# Altium schematic sheet Power_Distribution.SchDoc
size A4
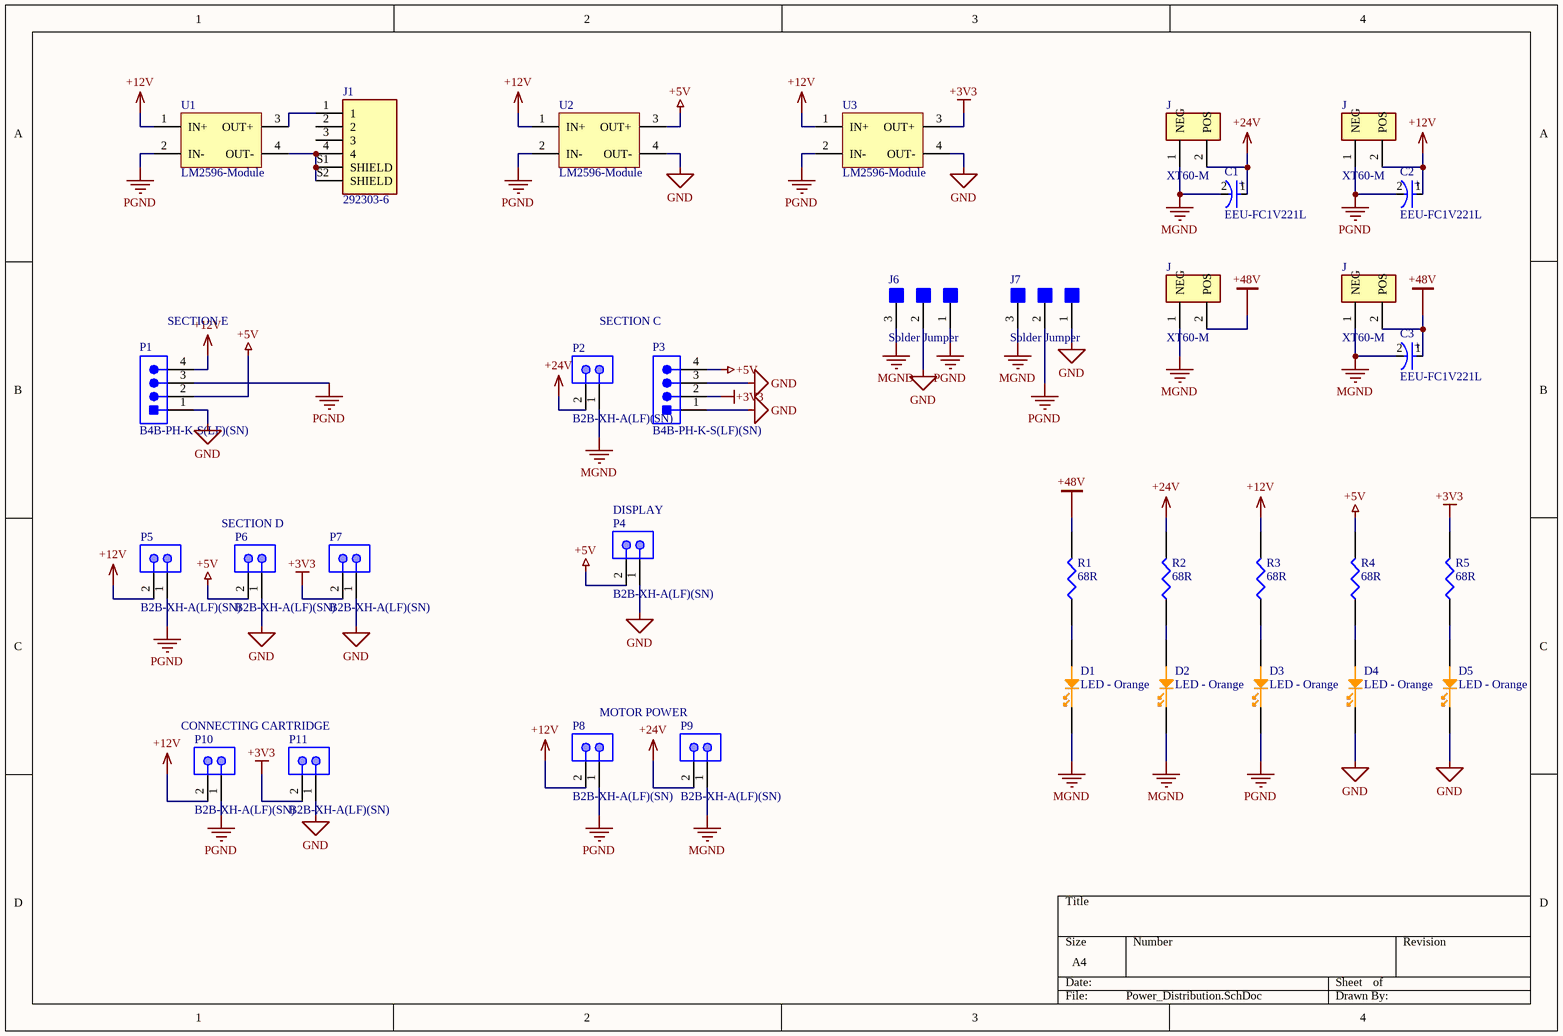
[diagram p0: Power_Distribution.SchDoc]

## Parts
(Parts that share a designator on the sheet are numbered #1, #2 ... from top to bottom, then left to right.)
C1  EEU-FC1V221L  [FP-EEU-FC1V221L-MFG]
C2  EEU-FC1V221L  [FP-EEU-FC1V221L-MFG]
C3  EEU-FC1V221L  [FP-EEU-FC1V221L-MFG]
D1  LED - Orange  [LED0603-Orange]
D2  LED - Orange  [LED0603-Orange]
D3  LED - Orange  [LED0603-Orange]
D4  LED - Orange  [LED0603-Orange]
D5  LED - Orange  [LED0603-Orange]
J1  292303-6  [TE_292303-6]
J6  Solder Jumper  [Solder Jumper]
J7  Solder Jumper  [Solder Jumper]
J#1  XT60-M  [AMASS_XT60-M]
J#2  XT60-M  [AMASS_XT60-M]
J#3  XT60-M  [AMASS_XT60-M]
J#4  XT60-M  [AMASS_XT60-M]
P1  B4B-PH-K-S(LF)(SN)  [JST-B4B-PH-K-S_V]
P2  B2B-XH-A(LF)(SN)  [JST-B2B-XH-A_V]
P3  B4B-PH-K-S(LF)(SN)  [JST-B4B-PH-K-S_V]
P4  B2B-XH-A(LF)(SN)  [JST-B2B-XH-A_V]
P5  B2B-XH-A(LF)(SN)  [JST-B2B-XH-A_V]
P6  B2B-XH-A(LF)(SN)  [JST-B2B-XH-A_V]
P7  B2B-XH-A(LF)(SN)  [JST-B2B-XH-A_V]
P8  B2B-XH-A(LF)(SN)  [JST-B2B-XH-A_V]
P9  B2B-XH-A(LF)(SN)  [JST-B2B-XH-A_V]
P10  B2B-XH-A(LF)(SN)  [JST-B2B-XH-A_V]
P11  B2B-XH-A(LF)(SN)  [JST-B2B-XH-A_V]
R1  68R  [68R 0603]
R2  68R  [68R 0603]
R3  68R  [68R 0603]
R4  68R  [68R 0603]
R5  68R  [68R 0603]
U1  LM2596-Module  [LM2596-FP]
U2  LM2596-Module  [LM2596-FP]
U3  LM2596-Module  [LM2596-FP]

## Nets
+3V3: P3.2 P7.2 P11.2 R5.2 U3.3(OUT+)
+5V: P1.2 P3.4 P4.2 P6.2 R4.2 U2.3(OUT+)
+12V: C2.1(C) J#2.2(POS) P1.4 P5.2 P8.2 P10.2 R3.2 U1.1(IN+) U2.1(IN+) U3.1(IN+)
+24V: C1.1(C) J#1.2(POS) P2.2 P9.2 R2.2
+48V: C3.1(C) J#3.2(POS) J#4.2(POS) R1.2
GND: D4.1(Cathode) D5.1(Cathode) J6.2 J7.1 P1.1 P3.1 P3.3 P4.1 P6.1 P7.1 P11.1 U2.4(OUT-) U3.4(OUT-)
MGND: C1.2(A) C3.2(A) D1.1(Cathode) D2.1(Cathode) J6.3 J7.3 J#1.1(NEG) J#3.1(NEG) J#4.1(NEG) P2.1 P9.1
PGND: C2.2(A) D3.1(Cathode) J6.1 J7.2 J#2.1(NEG) P1.3 P5.1 P8.1 P10.1 U1.2(IN-) U2.2(IN-) U3.2(IN-)
NetD1_2: D1.2(Anode) R1.1
NetD2_2: D2.2(Anode) R2.1
NetD3_2: D3.2(Anode) R3.1
NetD4_2: D4.2(Anode) R4.1
NetD5_2: D5.2(Anode) R5.1
NetJ1_1: J1.1 U1.3(OUT+)
NetJ1_4: J1.4 J1.S1(SHIELD) J1.S2(SHIELD) U1.4(OUT-)

Not connected (* = marked no-connect by the designer): J1 2 3

## Notes on the sheet
- (near P1) SECTION E
- SECTION C
- (near P4) DISPLAY
- (near P6) SECTION D
- MOTOR POWER
- CONNECTING CARTRIDGE
- (in symbol CMP-05427-000010-1) +

## Library data of the parts
C1-C3 = CMP-05427-000010-1: CAP ALUM 220UF 20% 35V RADIAL; Manufacturer: Panasonic Electronic Components; Material: Aluminum; Leakage Current: 77uA; Esr: 0.085Ω; Life: 2000Hours; Automotive Grade: Grade 2; Dissipation Factor: 12%; Ripple Current: 730mA; Octopart: https://octopart.com/eeu-fc1v221l-panasonic-39478519; ComponentLink2URL: https://industrial.panasonic.com/cdbs/www-data/pdf/RDF0000/ABA0000C1209.pdf; Package: 0; Height: 16.5mm; Category: Cap; Value: 220uF; ComponentLink2Description: Datasheet; Lead Free: Yes; Device Class L2: Capacitors; Temperature Range High: +105°C; Mouser Description: Capacitor; Aluminum Electrolytic; Fc Radial Elec Cap 220uF 35V; Temperature: -55°C to +105°C; Digikey Description: CAP ALUM 220UF 20% 35V RADIAL; Device Class L3: Aluminum Electrolytic Capacitors; Manufacturer Part Number: EEU-FC1V221L; Device Class L1: Passive Components; Automotive: Yes; RoHS: TRUE; Temperature Range Low: -55°C; Capacitance: 220uF; Voltage Rating: 35V; Tolerance: 20%
D1-D5 = LTST-C191KFKT: LED ORANGE CLEAR SMD; Manufacturer: Vishay Lite-On; Lens Color: Colorless; Wavelength: 611nm; Number of LEDs: 1; Viewing Angle: 130°; Lens Style: Diffused,Colorless,Rectangular; Luminous Intensity: 90mcd; Forward Current: 30mA; Forward Voltage: 2V; Power Rating: 75mW; Reverse Voltage: 5V; Dominant Wavelength: 605nm; Test Current: 20mA; Supplier 1: Digi-Key; Supplier Part Number 1: 160-1445-1-ND; Manufacturer Part Number: LTST-C191KFKT; RoHS: Yes; Category: LEDs; Stock 1: 92562; Pricing 1: 1=0.24000, 10=0.17900, 100=0.08460, 500=0.05640, 1000=0.04418, 2500=0.04324 (USD); Mount: Surface Mount; Case/Package: 0603; Number of Pins: 2; Case Code (Metric): 1608; Color: Orange; Case Code (Imperial): 0603; Min Operating Temperature: -55°C; Max Operating Temperature: 85°C; Package Quantity: 1; Packaging: Tape and Reel; Illumination Color: Orange; Lens Transparency: Clear; Number of Elements: 1; Power Dissipation: 75mW; Length: 1.6mm; Height: 0.55mm; Width: 0.8mm; Depth: 0.8mm; Radiation Hardening: No; Lead Free: Lead Free; ComponentLink1URL: https://datasheet.ciiva.com/2109/ltst-c191kfkt-2109968.pdf?src-supplier=Digi-Key; ComponentLink1Description: https://datasheet.ciiva.com/2109/ltst-c191kfkt-2109968.pdf?src-supplier=Digi-Key; ComponentLink2URL: https://datasheet.ciiva.com/12400/100-ltst-c191kfkt-39904-12400811.pdf?src-supplier=Mouser; ComponentLink2Description: https://datasheet.ciiva.com/12400/100-ltst-c191kfkt-39904-12400811.pdf?src-supplier=Mouser; ComponentLink3URL: https://datasheet.ciiva.com/11775/0900766b80dc02b0-11775613.pdf?src-supplier=RSComponents; ComponentLink3Description: https://datasheet.ciiva.com/11775/0900766b80dc02b0-11775613.pdf?src-supplier=RSComponents; ComponentLink4URL: https://datasheet.ciiva.com/15201/getdatasheetpartid-631075-15201391.pdf?src-supplier=Verical; ComponentLink4Description: https://datasheet.ciiva.com/15201/getdatasheetpartid-631075-15201391.pdf?src-supplier=Verical; ComponentLink5URL: https://datasheet.ciiva.com/2109/s-110-ltst-c191kfkt-2109969.pdf?src-supplier=Digi-Key; ComponentLink5Description: https://datasheet.ciiva.com/2109/s-110-ltst-c191kfkt-2109969.pdf?src-supplier=Digi-Key
J1 = 292303-6: Conn USB 2.0 Type A RCP 4 POS Solder RA Thru-Hole 4 Terminal 1 Port Tray|Tube; Centerline_Pitch: 2 mm[.078 in]; MF: TE Connectivity; Product_Type: Connector; Number_of_Positions: 4; Package: None; DigiKey-Purchase-URL: https://snapeda.com/shop?store=DigiKey&id=521495; MP: 292303-6; Price: None; Availability: Good; Value: *; EU_RoHS_Compliance: Compliant; Arrow_Electronics-Purchase-URL: https://snapeda.com/shop?store=Arrow+Electronics&id=521495; Mouser-Purchase-URL: https://snapeda.com/shop?store=Mouser&id=521495; SnapEDA_Link: https://www.snapeda.com/parts/292303-6/TE%20Connectivity%20AMP%20Connectors/view-part/521495/?ref=snap
J#1-J#4 = XT60-M: Plug; DC supply; XT60; male; PIN: 2; for cable; soldered; 30A; 500V; MF: AMASS; MP: XT60-M; Price: None; Package: Package Analog Devices; Value: *; Availability: Unavailable; SnapEDA_Link: https://www.snapeda.com/parts/XT60-M/AMASS/view-part/2883912/?ref=snap
P1 P3 = CMP-2000-05165-1: Male Header, Pitch 2 mm, 1 x 4 Position, Height 6 mm, Tail Length 3.4 mm, -25 to 85 degC, RoHS, Bulk; Manufacturer: JST; No of Positions: 4; Style/Orientation: StraightHeader/Plug; Pitch: 2mm; Datasheet URL: http://datasheet.octopart.com/B4B-PH-K-S%28LF%29%28SN%29-JST-datasheet-10558886.pdf; Type: ShroudedHeader; Manufacturer URL: http://www.jst.com/home2.html; Termination: Crimp; Datasheet Version: Apr-09
P2 P4-P11 = CMP-2000-05888-1: Male Header, Pitch 2.5 mm, 1 x 2 Position, Height 7 mm, Tail Length 3.4 mm, -25 to 85 degC, RoHS, Bulk; Manufacturer: JST; No of Positions: 2; Pitch: 2.5mm; Style/Orientation: StraightHeader/Plug; Datasheet Version: 05/2016; Package Description: Male Header, Pitch 2.5 mm, 1 x 2 Position, Height 7 mm, Tail Length 3.4 mm; Package Reference: B2B-XH-A; Mounting Technology: ThroughHole; Type: ShroudedHeader; Datasheet URL: http://www.jst-mfg.com/product/pdf/eng/eXH.pdf; Manufacturer URL: http://www.jst.com/home2.html; Termination: Crimp
R1-R5 = CRGP0603F68R: CRGP 0603 68R 1%; Manufacturer: TE Connectivity; Max Power Dissipation: 250mW; Temperature Coefficient: 200ppm/°C; Supplier 1: Digi-Key; Supplier Part Number 1: A130402CT-ND; Manufacturer Part Number: CRGP0603F68R; RoHS: No; Category: Chip SMD Resistors; Stock 1: 49308; Pricing 1: 1=0.14000, 10=0.11400, 100=0.04470, 1000=0.01870, 2500=0.01714 (USD); Case/Package: 0603; Case Code (Imperial): 0603; Case Code (Metric): 1608; Min Operating Temperature: -55°C; Max Operating Temperature: 155°C; Resistor Type: Thick Film; Packaging: Tape and Reel; Resistance: 68R; Tolerance: 1%; Number of Terminations: 2; ComponentLink1URL: https://www.te.com/commerce/DocumentDelivery/DDEController?Action=srchrtrv&amp;DocNm=9-1773463-9&amp;DocType=DS&amp;DocLang=English&src-supplier=Digi-Key; ComponentLink1Description: https://www.te.com/commerce/DocumentDelivery/DDEController?Action=srchrtrv&amp;DocNm=9-1773463-9&amp;DocType=DS&amp;DocLang=English&src-supplier=Digi-Key